# Altium schematic sheet Extension sheet.SchDoc: Extension serials
size A; DrawnBy: Mr.Farhad Jafari; Engineer: Mr.Farhad Jafari; Address1: www.BasetP.com; Address2: www.BasetP.com; Address3: www.BasetP.com; Address4: www.BasetP.com; Revision: V1.1; SheetNumber: 4; SheetTotal: 5; ProjectName: Humanoid robot
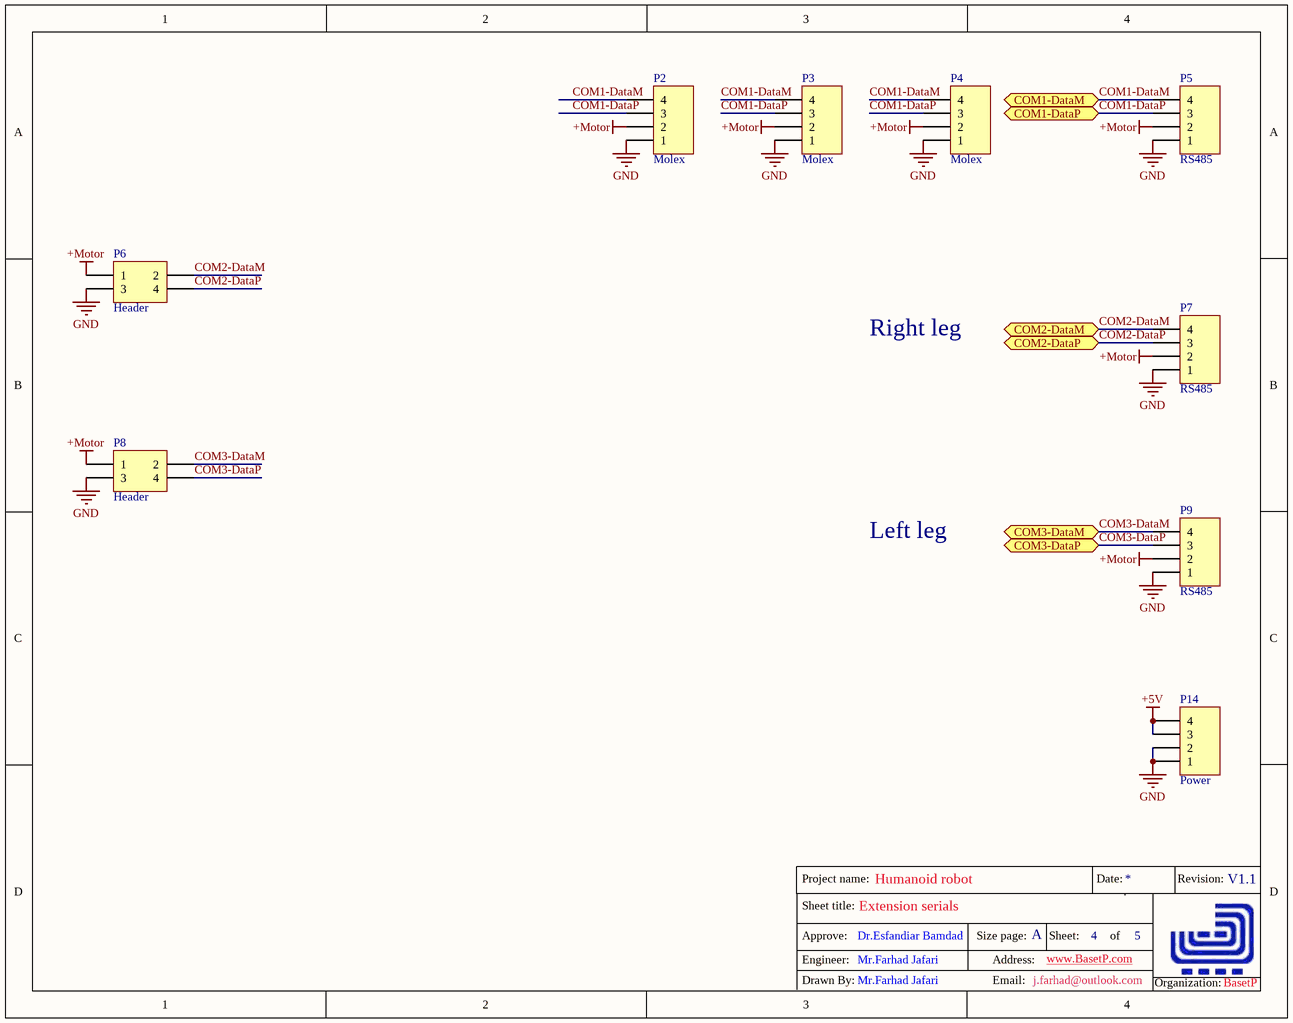
[diagram p0: Extension sheet.SchDoc]

## Parts
P2  Molex  [HDR1*4]
P3  Molex  [HDR1*4]
P4  Molex  [HDR1*4]
P5  RS485  [HDR1*4]
P6  Header  [connector 2*2]
P7  RS485  [HDR1*4]
P8  Header  [connector 2*2]
P9  RS485  [HDR1*4]
P14  Power  [HDR1X4]

## Ports
COM1-DataM, COM1-DataP, COM2-DataM, COM2-DataP, COM3-DataM, COM3-DataP

## Nets
+5V: P14.3 P14.4
+Motor: P2.2 P3.2 P4.2 P5.2 P6.1 P7.2 P8.1 P9.2
GND: P2.1 P3.1 P4.1 P5.1 P6.3 P7.1 P8.3 P9.1 P14.1 P14.2
COM1-DataM: P2.4 P3.4 P4.4 P5.4 ; port COM1-DataM
COM1-DataP: P2.3 P3.3 P4.3 P5.3 ; port COM1-DataP
COM2-DataM: P6.2 P7.4 ; port COM2-DataM
COM2-DataP: P6.4 P7.3 ; port COM2-DataP
COM3-DataM: P8.2 P9.4 ; port COM3-DataM
COM3-DataP: P8.4 P9.3 ; port COM3-DataP

## Notes on the sheet
- Right leg
- Left leg
- Sheet title:
- Project name:
- Date:
- Revision:
- Engineer:
- Approve:
- Dr.Esfandiar Bamdad
- Size page:
- Address:
- A
- www.BasetP.com
- Sheet:
- of
- Drawn By:
- Mr.Farhad Jafari
- Email:
- j.farhad@outlook.com
- Organization:
- BasetP

## Library data of the parts
P2-P5 P7 P9 = Molex 4pin: Molex pin circular
P6 P8 = Header 2X2 right angle: Header, 4-Pin, 2X2 right angle; LatestRevisionDate: 17-Jul-2002; LatestRevisionNote: Re-released for DXP Platform.; Publisher: Altium Limited
P14 = Header 4: Header, 4-Pin; LatestRevisionDate: 17-Jul-2002; LatestRevisionNote: Re-released for DXP Platform.; Publisher: Altium Limited